# Altium schematic sheet POW_Schematic2.SchDoc
size A4
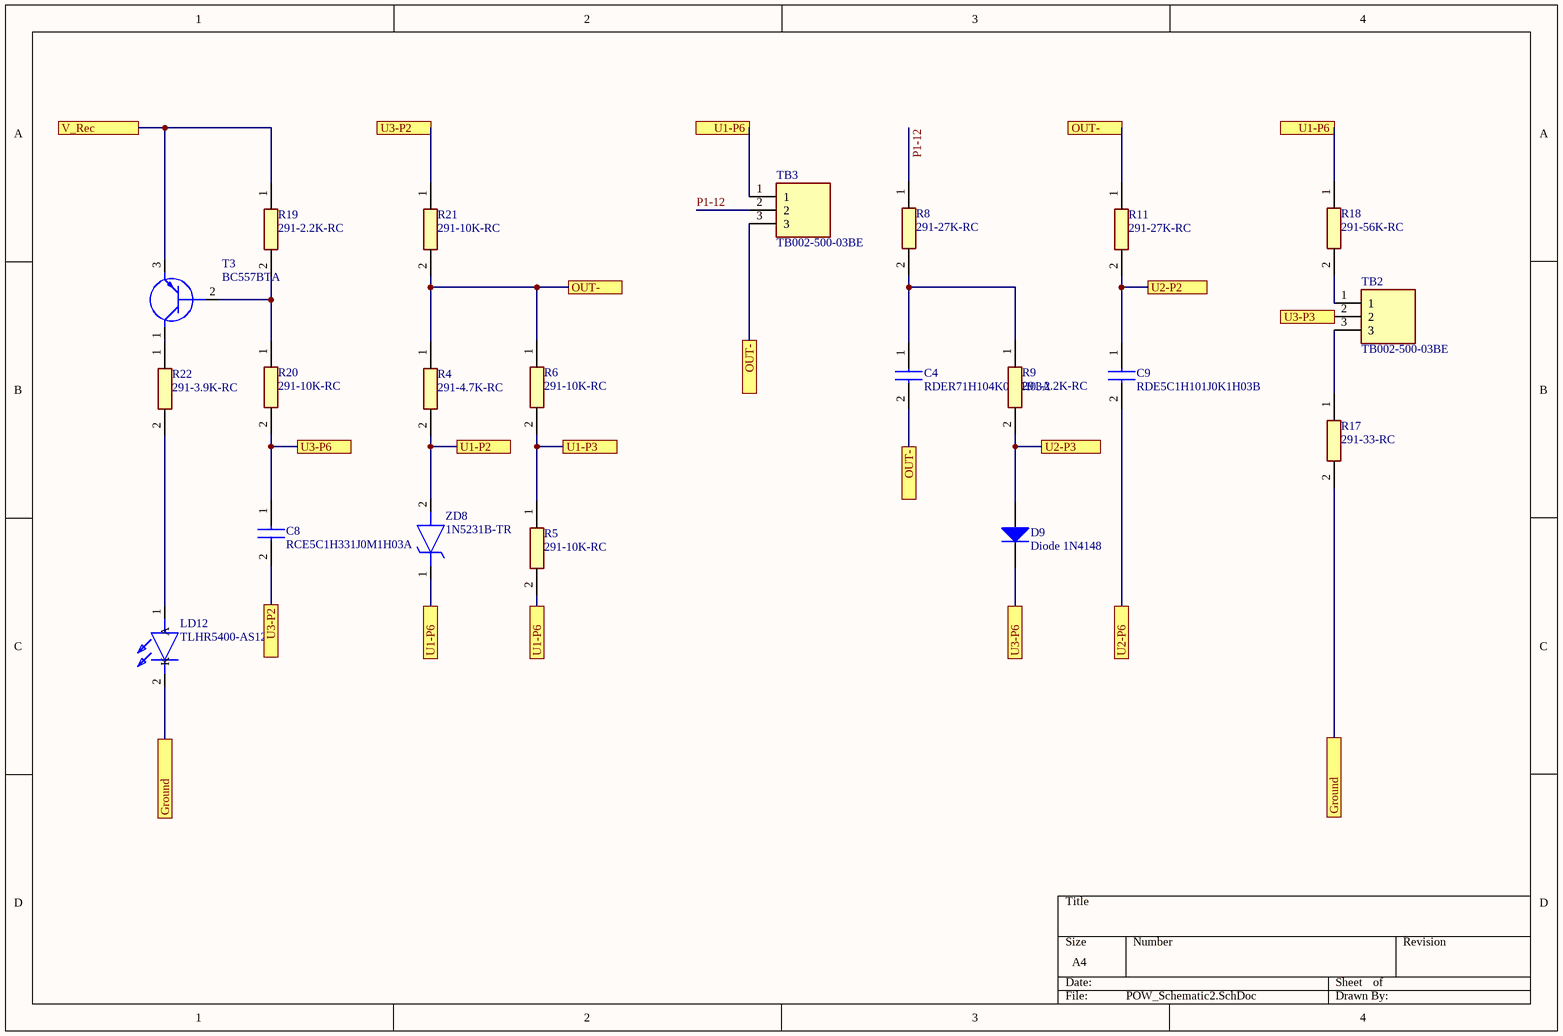
[diagram p0: POW_Schematic2.SchDoc]

## Parts
C4  RDER71H104K0S1H03A  [RDE5C1H100J0P1H03B]
C8  RCE5C1H331J0M1H03A  [RCE5C1H100J0A2H03B]
C9  RDE5C1H101J0K1H03B  [RCE5C1H103J1A2H03B]
D9  Diode 1N4148  [DO-35]
LD12  TLHR5400-AS12Z  [TLHR5400AS12Z]
R4  291-4.7K-RC  [291-XXX-RC-Type]
R5  291-10K-RC  [291-XXX-RC-Type]
R6  291-10K-RC  [291-XXX-RC-Type]
R8  291-27K-RC  [291-XXX-RC-Type]
R9  291-2.2K-RC  [291-XXX-RC-Type]
R11  291-27K-RC  [291-XXX-RC-Type]
R17  291-33-RC  [291-XXX-RC-Type]
R18  291-56K-RC  [291-XXX-RC-Type]
R19  291-2.2K-RC  [291-XXX-RC-Type]
R20  291-10K-RC  [291-XXX-RC-Type]
R21  291-10K-RC  [291-XXX-RC-Type]
R22  291-3.9K-RC  [291-XXX-RC-Type]
T3  BC557BTA  [TO260P419X476X877-3P]
TB2  TB002-500-03BE  [SHDR3W100P0X500_1X3_1500X760X1000P]
TB3  TB002-500-03BE  [SHDR3W100P0X500_1X3_1500X760X1000P]
ZD8  1N5231B-TR  [DIOAD990W55L350D160]

## Ports
Ground, OUT-, U1-P2, U1-P3, U1-P6, U2-P2, U2-P3, U2-P6, U3-P2, U3-P3, U3-P6, V_Rec

## Nets
Ground: LD12.2(K) R17.2 ; port Ground
OUT-: C4.2 R4.1 R6.1 R11.1 R21.2 TB3.3 ; port OUT-
P1-12: R8.1 TB3.2
U1-P2: R4.2 ZD8.2(A) ; port U1-P2
U1-P3: R5.1 R6.2 ; port U1-P3
U1-P6: R5.2 R18.1 TB3.1 ZD8.1(K) ; port U1-P6
U2-P2: C9.1 R11.2 ; port U2-P2
U2-P3: D9.1(A) R9.2 ; port U2-P3
U2-P6: C9.2 ; port U2-P6
U3-P2: C8.2 R21.1 ; port U3-P2
U3-P3: TB2.2 ; port U3-P3
U3-P6: C8.1 D9.2(K) R20.2 ; port U3-P6
V_Rec: R19.1 T3.3(E) ; port V_Rec
NetC4_1: C4.1 R8.2 R9.1
NetLD12_1: LD12.1(A) R22.2
NetR17_1: R17.1 TB2.3
NetR18_2: R18.2 TB2.1
NetR19_2: R19.2 R20.1 T3.2(B)
NetR22_1: R22.1 T3.1(C)

## Library data of the parts
C4 = RDER71H104K0S1H03A: Capacitor; Manufacturer_Name: Murata Electronics; Datasheet Link: https://psearch.en.murata.com/capacitor/product/RDER71H104K0S1H03A.html; Height: 6mm; Manufacturer_Part_Number: RDER71H104K0S1H03A; Mouser Part Number: 81-RDER71H104K0S1H3A; Mouser Price/Stock: https://www.mouser.com/Search/Refine.aspx?Keyword=81-RDER71H104K0S1H3A
C8 = RCE5C1H331J0M1H03A: Capacitor; Manufacturer_Name: Murata Electronics; Datasheet Link: https://psearch.en.murata.com/capacitor/product/RCE5C1H331J0M1H03A.html; Height: 5mm; Manufacturer_Part_Number: RCE5C1H331J0M1H03A
C9 = RDE5C1H101J0K1H03B: Capacitor; Manufacturer_Name: Murata Electronics; Datasheet Link: https://psearch.en.murata.com/capacitor/product/RDE5C1H101J0K1H03B.html; Height: 5mm; Manufacturer_Part_Number: RDE5C1H101J0K1H03B; Mouser Part Number: 81-RDE5C1H101J0K1H3B; Mouser Price/Stock: https://www.mouser.com/Search/Refine.aspx?Keyword=81-RDE5C1H101J0K1H3B
D9 = Diode 1N4148: High Conductance Fast Diode; Published: 8-Jun-2000; LatestRevisionDate: 17-Jul-2002; LatestRevisionNote: Re-released for DXP Platform.; DatasheetVersion: 1997; PackageReference: DO-35; Publisher: Altium Limited; PackageDescription: Diode, Axial; Body 3.8 x 1.9 mm (LxDia. max), Lead Dia. 0.53 mm (max); Code_JEDEC: DO-204-AH; ComponentLink1Description: Manufacturer Link; ComponentLink1URL: http://www.fairchildsemi.com/; ComponentLink2Description: Datasheet; ComponentLink2URL: http://www.fairchildsemi.com/ds/1N%2F1N4148.pdf
LD12 = TLHR5400-AS12Z: LED; Manufacturer_Name: Vishay; Datasheet Link: http://www.vishay.com/docs/83012/tlhg540.pdf; Height: 12.8mm; Manufacturer_Part_Number: TLHR5400-AS12Z; Mouser Part Number: 78-TLHR5400-AS12Z; Mouser Price/Stock: https://www.mouser.com/Search/Refine.aspx?Keyword=78-TLHR5400-AS12Z
T3 = BC557BTA: Transistor BJT PNP; Manufacturer_Name: ON Semiconductor; Datasheet Link: https://componentsearchengine.com/Datasheets/2/BC557BTA.pdf; Height: 4.19mm; Manufacturer_Part_Number: BC557BTA; Mouser Part Number: 512-BC557BTA; Mouser Price/Stock: https://www.mouser.com/Search/Refine.aspx?Keyword=512-BC557BTA; RS Part Number: 7613505P; RS Price/Stock: http://uk.rs-online.com/web/p/products/7613505P
TB2 TB3 = TB002-500-03BE: Connector; Manufacturer_Name: CUI Devices; Datasheet Link: https://www.cuidevices.com/product/resource/tb002-500.pdf; Height: 10mm; Manufacturer_Part_Number: TB002-500-03BE; Mouser Part Number: 490-TB002-500-03BE; Mouser Price/Stock: https://www.mouser.com/Search/Refine.aspx?Keyword=490-TB002-500-03BE
ZD8 = 1N5231B-TR: Zener Diode; Manufacturer_Name: Vishay; Allied_Number: 70061636; Datasheet Link: http://www.vishay.com/docs/85588/1n5221.pdf; Manufacturer_Part_Number: 1N5231B-TR; Mouser Part Number: 78-1N5231B; Mouser Price/Stock: https://www.mouser.com/Search/Refine.aspx?Keyword=78-1N5231B; RS Part Number: 8115967P; RS Price/Stock: http://uk.rs-online.com/web/p/products/8115967P; Allied Price/Stock: https://www.alliedelec.com/vishay-smallsignal-optoproducts-ssp-1n5231b-tr/70061636/